# EAGLE design mug_marcbrakout (EAGLE 5.11)
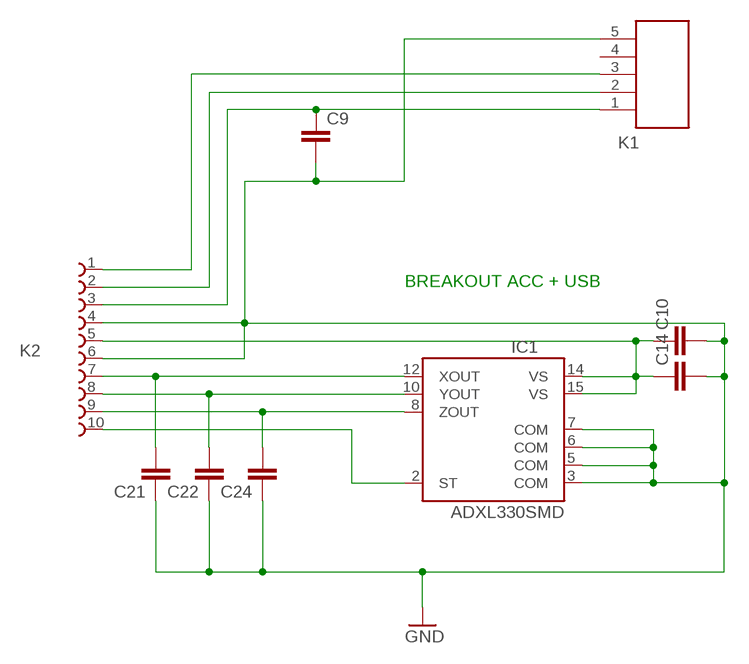
[diagram p0: schematic, sheet 1]

## Parts
C9  C-EUC0805  [C0805]
C10  C-EUC0805  [C0805]
C14  C-EUC0805  [C0805]
C21  C-EUC0805  [C0805]
C22  C-EUC0805  [C0805]
C24  C-EUC0805  [C0805]
IC1  ADXL330SMD  [LFCSP-16]
K1  651005136421  [651005136421]
K2  68611014422  [68611014422]

## Nets
GND: C9.2 C10.2 C14.2 C21.1 C22.1 C24.1 IC1.3(COM) IC1.5(COM) IC1.6(COM) IC1.7(COM) K1.5 K2.4 K2.6
N$8: K1.3 K2.1
N$14: K1.2 K2.2
N$16: C9.1 K1.1 K2.3
N$32: C24.2 IC1.8(ZOUT) K2.9
N$35: C21.2 IC1.12(XOUT) K2.7
N$42: IC1.2(ST) K2.10
N$44: C10.1 C14.1 IC1.14(VS) IC1.15(VS) K2.5
N$47: C22.2 IC1.10(YOUT) K2.8
Unconnected: K1.4

## Notes on the sheet
- BREAKOUT ACC + USB

## Library data of the parts
C9 C10 C14 C21 C22 C24 = rcl:C-EU: CAPACITOR, European symbol
IC1 = SparkFun:ADXL330: Triple Axis Accelerometer Analog Devices ADXL330 +/-3g 2.4V-5.25V Analog output. Spark Fun Electronics SKU : COM-00730. Center pad paste layer has been reduced to avoid shorting.
K1 = Wuerth_Elektronik_eiCan_11_Communication_Connectors_:651005136421: WR-COM Vertical 5 Contacts Mini USB Type B, 5 pins
K2 = Wuerth_Elektronik_eiCan_03_ZIF_Connectors_Flat_Flexible_Cable:68611014422: WR-FPC 1.00mm SMT ZIF Horizontal Bottom Contact, 10 Pins

## Board
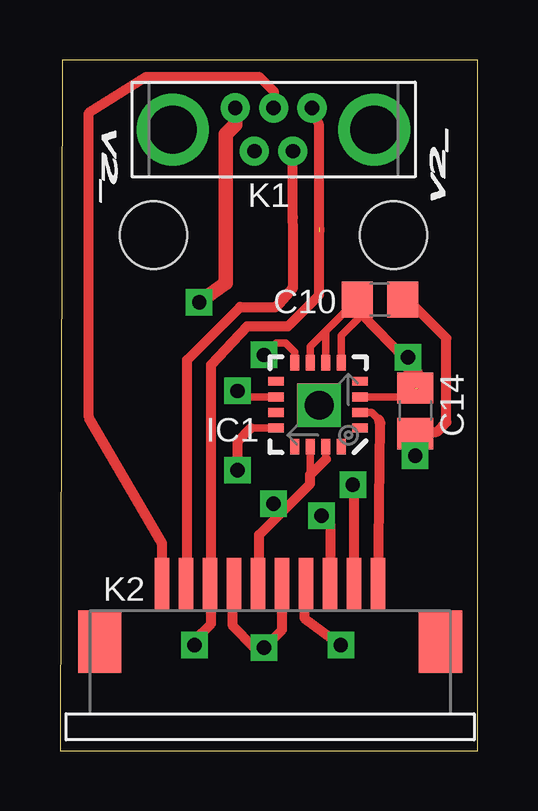
[diagram p1: board, top side]
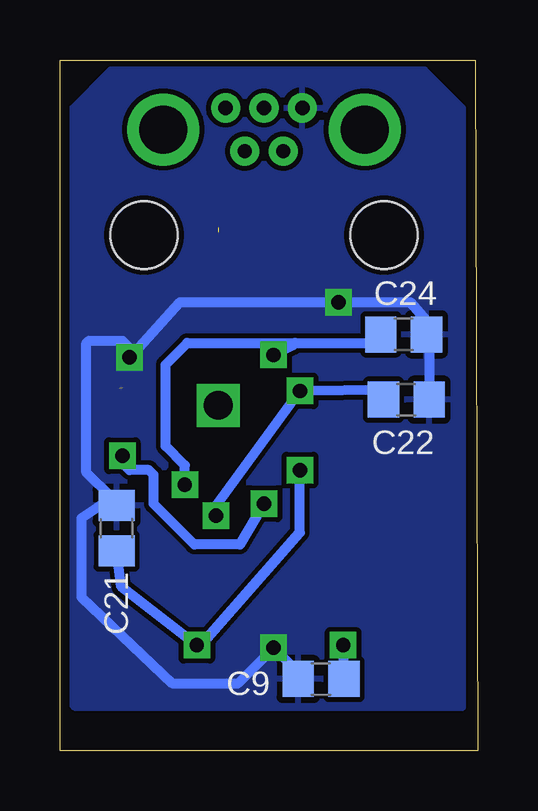
[diagram p2: board, bottom side, seen from below]

Size 17.4 x 28.8 mm. Coordinates in mm from the lower left corner, seen from the top.
Outline: 0,0 17.4,0 17.4,28.8 0.1,28.8 0,0
Copper layers (1*16): Top 0.035mm / dielectric 1.5mm / Bottom 0.035mm
Design rules "V2_ *": minimum track width 8mil, minimum drill 20mil, track to track 8mil, track to pad 8mil, pad to pad 8mil, via to via 8mil, smd to smd 0mil, copper to edge 10mil, drill to drill 8mil, minimum pad ring 12mil, minimum via ring 10mil, stop-mask expansion 4mil, vias tented up to drill 25mil, thermal gap 10mil
Holes 2.8 mm at 3.9,21.5 13.9,21.5

### Footprints (pad centres in the part's own frame; a part is rotated, then mirrored left to right if it is on the bottom)
C0805 = smd 1.3 x 1.5: 1 -0.95,0; 2 0.95,0
LFCSP-16 = smd 1.75 x 1.75: 0 0,0 | smd 0.65 x 0.37: 1 -1.75,0.975; 2 -1.75,0.325; 3 -1.75,-0.325; 4 -1.75,-0.975; 9 1.75,-0.975; 10 1.75,-0.325; 11 1.75,0.325; 12 1.75,0.975 | smd 0.37 x 0.65: 5 -0.975,-1.75; 6 -0.325,-1.75; 7 0.325,-1.75; 8 0.975,-1.75; 13 0.975,1.75; 14 0.325,1.75; 15 -0.325,1.75; 16 -0.975,1.75
651005136421 = drill 0.6 round: 1 0.9,-1.6; 2 -0.9,-0.8; 3 0.9,0; 4 -0.9,0.8; 5 0.9,1.6 | drill 2 round: Z1 0,4.2; Z2 0,-4.2
68611014422 = smd 0.6 x 2.2: 1 -7.5,1.1; 2 -6.5,1.1; 3 -5.5,1.1; 4 -4.5,1.1; 5 -3.5,1.1; 6 -2.5,1.1; 7 -1.5,1.1; 8 -0.5,1.1; 9 0.5,1.1; 10 1.5,1.1 | smd 1.8 x 2.6: Z1 -10.1,-1.3; Z2 4.1,-1.3

### Placement (x,y rotation side)
C9  6.52,2.99 180 bottom
C10  13.33,18.81 180 top
C14  14.81,14.17 90 top
C21  15.04,9.28 270 bottom
C22  2.97,14.64 180 bottom
C24  3.08,17.36 180 bottom
IC1  10.75,14.43 180 top
K1  8.9,25.9 90 top
K2  11.75,5.85 0 top
U$1  [V2_LOGO_XS]  1.2,26.2 270 top
U$2  [V2_LOGO_S]  12.7,12.1 0 top
U$3  [V2_LOGO_XS]  16.6,22.6 90 top

### Tracks (layer width: path | path; a pad name or v marks a point on that pad's centre or on a via)
GND  (via drill 0.6)  (1 unrouted)
  Top 0.305: IC1.7 10.43,16.86 11.38,17.82 | 11.38,17.82 12.12,18.55 | IC1.5 11.72,17.31 12.6,18.19 | IC1.6 11.07,17.5 11.38,17.82 | IC1.3 14.45,14.76 C14.2
  Top 0.406: 14.81,15.46 C14.2 14.5,15.43 v14.5,16.4 | 12.12,18.55 C10.2 12.7,18.49 12.3,18.5 12.6,18.19 14.9,15.8 14.9,15.1 14.55,14.76 | K2.4 7.2,6.9 7.2,5.2 8.1,4.3 v8.5,4.3 9.25,5.05 K2.6
  Top 0.61: K1.5 7.3,26.1 6.9,25.7 6.9,19.5 v5.8,18.7
  Bottom 0.406: C9.2 7.47,3.27 v8.5,4.3 10,2.8 12.7,2.8 16.5,6.4 16.5,9.7 15.27,10.53 C21.1 15.23,10.53 16.3,11.6 16.3,17 16.2,17.1 14.8,17.1 14.5,16.8 v14.5,16.4 12.4,18.7 v5.8,18.7 2.8,18.7 2.13,17.93 C24.1 2.02,17.25 C22.1
  pour Bottom: 0.6,1.8 0.6,26.8 2.2,28.4 15.3,28.4 16.9,26.8 16.9,1.9 16.8,1.8
N$8
  Top 0.406: K1.3 8.9,27.5 8.3,28.1 3.6,28.1 1.2,26.6 1.2,13.9 4.25,8.65 K2.1
N$14
  Top 0.406: K2.2 5.3,7.2 5.3,16.3 7.5,18.5 9,18.5 9.71,19.31 9.71,21.72 9.7,22.23 K1.2
N$16  (via drill 0.6)  (1 unrouted)
  Top 0.406: v5.6,4.4 5.6,4.6 6.3,5.3 6.3,6.9 K2.3 6.3,7 6.3,16.1 7.8,17.7 9.5,17.7 10.8,19 10.8,21.81 | K1.1 10.8,26.1 10.8,21.81 | 10.8,21.81 10.8,21.63
  Bottom 0.406: C9.1 5.57,4.37 v5.6,4.4
N$32  (via drill 0.6)
  Top 0.305: IC1.8 9.78,16.62 9.4,17 9,17 v8.5,16.5
  Top 0.406: K2.9 12.25,11.05 v12.2,11.1
  Bottom 0.406: v12.2,11.1 12.2,11.9 13,12.7 13,16.1 12.1,17 7.6,17 | 7.6,17 4.39,17 C24.2 | v8.5,16.5 7.7,16.9 7.6,17
N$35  (via drill 0.6)
  Top 0.305: 7.96,13.46 IC1.12
  Top 0.406: v11.7,4.4 10.2,5.5 10.2,6.9 K2.7 | 7.96,13.46 7.4,12.9 v7.4,11.7
  Bottom 0.406: C21.2 14.84,6.84 v11.7,4.4 11.7,4.2 7.4,9.1 v7.4,11.7
N$41  (via drill 1.2)
  other vias: 10.8,14.4
N$42
  Top 0.305: IC1.2 12.99,14.11 13.3,13.8
  Top 0.406: K2.10 13.35,13.65 13.3,13.8
N$44  (via drill 0.6)
  Top 0.305: 10.43,11.3 IC1.14 | 11.07,12.15 IC1.15
  Top 0.406: 9.2,9.9 8.3,9 8.3,7 K2.5 | 9.2,9.9 10.43,11.12 10.43,11.3 10.43,11.5 11.07,12.15 | C10.1 14.28,19.02 16.1,17.2 16.1,13.7 15.7,13.3 14.89,13.3 C14.1 v14.81,12.31 v14.8,12.3 | v8.9,10.3 8.9,10.2 9.2,9.9
  Bottom 0.406: v14.8,12.3 14.8,12 14.5,11.7 13.7,11.7 13.5,11.5 13.5,10.3 11.8,8.6 9.9,8.6 v8.9,10.3
N$47  (via drill 0.6)
  Top 0.305: IC1.10 7.86,14.76 7.8,14.7
  Top 0.406: v7.4,15 7.3,14.9 7.8,14.7 7.14,14.8 | K2.8 11.25,9.45 v10.9,9.8
  Bottom 0.406: C22.2 3.76,15.04 v7.4,15 10.9,10.2 v10.9,9.8